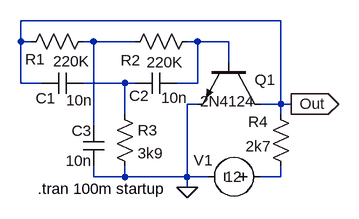
[diagram p0: schematic 1Q2BleteOsc.asc]
1Q2BleteOsc.asc, the LTspice schematic file:
Version 4
SHEET 1 880 680
WIRE -128 208 -128 176
WIRE -128 272 -128 208
WIRE -112 208 -128 208
WIRE -96 272 -128 272
WIRE -16 208 -32 208
WIRE -16 336 -16 208
WIRE -16 416 -16 400
WIRE 32 272 -32 272
WIRE 32 320 32 272
WIRE 32 416 -16 416
WIRE 32 416 32 400
WIRE 48 208 -16 208
WIRE 48 272 32 272
WIRE 128 416 32 416
WIRE 128 416 128 304
WIRE 128 432 128 416
WIRE 144 208 128 208
WIRE 144 272 112 272
WIRE 144 272 144 208
WIRE 144 304 128 304
WIRE 160 416 128 416
WIRE 192 208 144 208
WIRE 192 240 192 208
WIRE 272 176 -128 176
WIRE 272 304 240 304
WIRE 272 304 272 176
WIRE 272 320 272 304
WIRE 272 416 240 416
WIRE 272 416 272 400
WIRE 288 304 272 304
FLAG 128 432 0
FLAG 288 304 Out
IOPIN 288 304 Out
SYMBOL npn2 240 240 R90
WINDOW 0 27 -24 VRight 0
WINDOW 3 60 7 VRight 0
SYMATTR InstName Q1
SYMATTR Value 2N4124
SYMBOL res -16 192 R90
WINDOW 0 59 90 VBottom 0
WINDOW 3 31 34 VTop 0
SYMATTR InstName R1
SYMATTR Value 220K
SYMATTR SpiceLine tol=1 pwr=0.1
SYMBOL res 144 192 R90
WINDOW 0 60 103 VBottom 0
WINDOW 3 32 50 VTop 0
SYMATTR InstName R2
SYMATTR Value 220K
SYMATTR SpiceLine tol=1 pwr=0.1
SYMBOL res 16 304 R0
SYMATTR InstName R3
SYMATTR Value 3k9
SYMATTR SpiceLine tol=1 pwr=0.1
SYMBOL res 256 304 R0
WINDOW 0 -34 27 Left 0
WINDOW 3 -38 65 Left 0
SYMATTR InstName R4
SYMATTR Value 2k7
SYMATTR SpiceLine tol=1 pwr=0.1
SYMBOL cap -32 256 R90
WINDOW 0 55 58 VBottom 0
WINDOW 3 27 6 VTop 0
SYMATTR InstName C1
SYMATTR Value 10n
SYMBOL cap 112 256 R90
WINDOW 0 51 58 VBottom 0
WINDOW 3 23 4 VTop 0
SYMATTR InstName C2
SYMATTR Value 10n
SYMBOL cap -32 336 R0
WINDOW 0 -18 9 Left 0
WINDOW 3 -27 55 Left 0
SYMATTR InstName C3
SYMATTR Value 10n
SYMBOL voltage 256 416 R90
WINDOW 0 -10 103 VBottom 0
WINDOW 3 -16 57 VTop 0
SYMATTR InstName V1
SYMATTR Value 12
TEXT -102 434 Left 0 !.tran 100m startup

The netlist it stands for:
* 1Q2BleteOsc.asc
Q1 Out N003 0 0 2N4124
R1 N001 Out 220K tol=1 pwr=0.1
R2 N003 N001 220K tol=1 pwr=0.1
R3 N002 0 3k9 tol=1 pwr=0.1
R4 Out N004 2k7 tol=1 pwr=0.1
C1 N002 Out 10n
C2 N003 N002 10n
C3 N001 0 10n
V1 N004 0 12
.model NPN NPN
.model PNP PNP
.lib standard.bjt
.tran 100m startup
.backanno
.end